# Altium schematic sheet TSAL.SchDoc
size A4; SheetNumber: 1; SheetTotal: 1
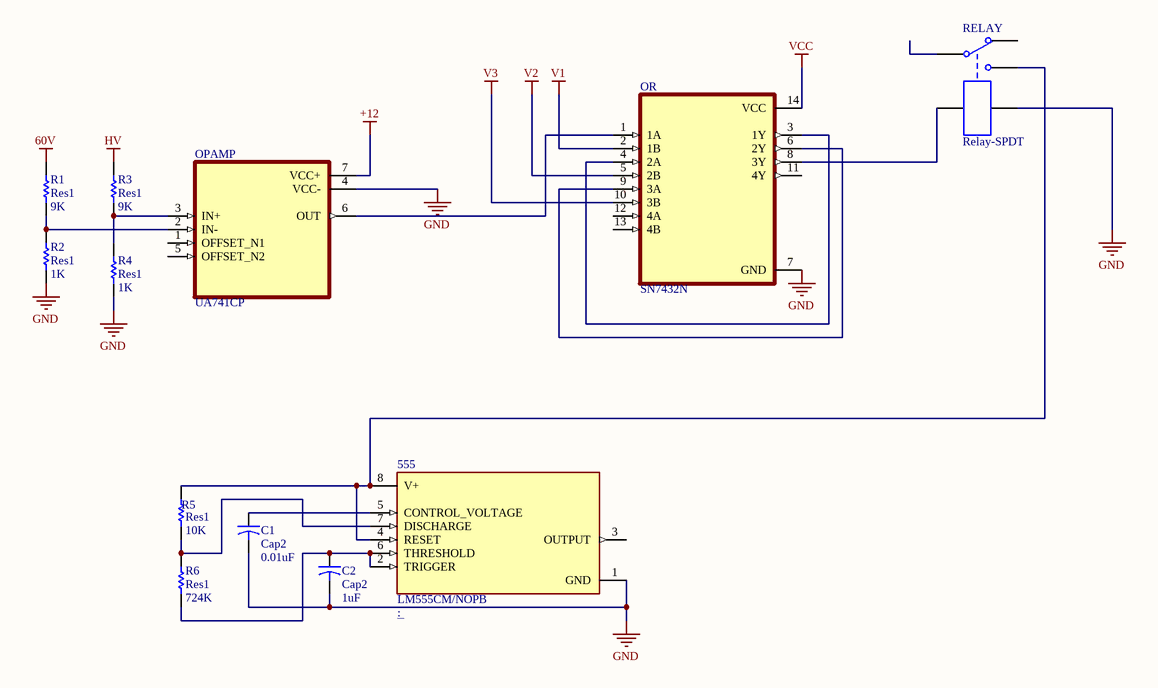
[diagram p0: TSAL.SchDoc]

## Parts
555  LM555CM/NOPB  [SOIC127P599X175-8N]
C1  Cap2  value 0.01uF  [CAPR5-4X5]
C2  Cap2  value 1uF  [CAPR5-4X5]
OPAMP  UA741CP  [DIP794W45P254L959H508Q8]
OR  SN7432N  [DIP794W45P254L1969H508Q14]
R1  Res1  value 9K  [AXIAL-0.3]
R2  Res1  value 1K  [AXIAL-0.3]
R3  Res1  value 9K  [AXIAL-0.3]
R4  Res1  value 1K  [AXIAL-0.3]
R5  Res1  value 10K  [AXIAL-0.3]
R6  Res1  value 724K  [AXIAL-0.3]
RELAY  Relay-SPDT  [MODULE5B]

## Nets
60V: R1.1
+12: OPAMP.7(VCC+)
GND: 555.1(GND) C1.2 C2.2 OPAMP.4(VCC-) OR.7(GND) R2.2 R4.2 RELAY.5
HV: R3.1
V1: OR.2(1B)
V2: OR.5(2B)
V3: OR.10(3B)
VCC: OR.14(VCC)
Net555_2: 555.2(TRIGGER) 555.6(THRESHOLD) C2.1 R6.2
Net555_4: 555.4(RESET) 555.8(V+) R5.1 RELAY.3
Net555_5: 555.5(CONTROL_VOLTAGE) C1.1
Net555_7: 555.7(DISCHARGE) R5.2 R6.1
NetOPAMP_2: OPAMP.2(IN-) R1.2 R2.1
NetOPAMP_3: OPAMP.3(IN+) R3.2 R4.1
NetOPAMP_6: OPAMP.6(OUT) OR.1(1A)
NetOR_3: OR.3(1Y) OR.4(2A)
NetOR_6: OR.6(2Y) OR.9(3A)
NetOR_8: OR.8(3Y) RELAY.4

Not connected (* = marked no-connect by the designer): 555 3(OUTPUT); OPAMP 1(OFFSET_N1) 5(OFFSET_N2); OR 11(4Y) 12(4A) 13(4B); RELAY 1 2

## Library data of the parts
555 = LM555CM/NOPB: Highly Stable 555 Timer 8-SOIC 0 to 70; MF: Texas Instruments; Package: SOIC-8 Texas Instruments; DigiKey-Purchase-URL: https://snapeda.com/shop?store=DigiKey&id=50124; Value: *; Mouser-Purchase-URL: https://snapeda.com/shop?store=Mouser&id=50124; Availability: Good; SnapEDA_Link: https://www.snapeda.com/parts/LM555CM/NOPB/Texas%20Instruments/view-part/50124/?ref=snap; MP: LM555CM/NOPB; Price: None; Arrow_Asia-Purchase-URL: https://snapeda.com/shop?store=Arrow+Asia&id=50124; Texas_Instruments-Purchase-URL: https://snapeda.com/shop?store=Texas+Instruments&id=50124
C1 C2 = Cap2: Capacitor; Published: 23-Sep-2002; PackageReference: CAPR5-4X5; Publisher: Altium Limited; PackageDescription: Capacitor; 2 Leads
OPAMP = UA741CP: General-Purpose Operational Amplifier; MF: Texas Instruments; Price: None; Package: PDIP-8 Texas Instruments; Texas_Instruments-Purchase-URL: https://snapeda.com/shop?store=Texas+Instruments&id=50768; Availability: Unavailable; MP: UA741CP; Value: *; SnapEDA_Link: https://www.snapeda.com/parts/UA741CP/Texas%20Instruments/view-part/50768/?ref=snap
OR = SN7432N: Quad 2-input positive-OR gates 14-PDIP 0 to 70; MF: Texas Instruments; Purchase-URL: https://pricing.snapeda.com/search/part/SN7432N/?ref=eda; Check_prices: https://www.snapeda.com/parts/SN7432N/Texas%20Instruments/view-part/390128/?ref=eda; SnapEDA_Link: https://www.snapeda.com/parts/SN7432N/Texas%20Instruments/view-part/390128/?ref=snap; Price: None; Availability: Good; Package: PDIP-14 Texas Instruments; MP: SN7432N; Value: *
R1-R6 = Res1: Resistor; Published: 8-Jun-2000; LatestRevisionDate: 17-Jul-2002; LatestRevisionNote: Re-released for DXP Platform.; PackageReference: AXIAL-0.3; Publisher: Altium Limited; PackageDescription: Axial Device, Thru-Hole; 2 Leads; 0.3 in Pin Spacing
RELAY = Relay-SPDT: Single-Pole Dual-Throw Relay; Published: 24-Mar-1999; LatestRevisionDate: 17-Jul-2002; LatestRevisionNote: Re-released for DXP Platform.; PackageReference: MODULE5B; Publisher: Altium Limited